# Altium project DRV8711EVM.PrjPCB
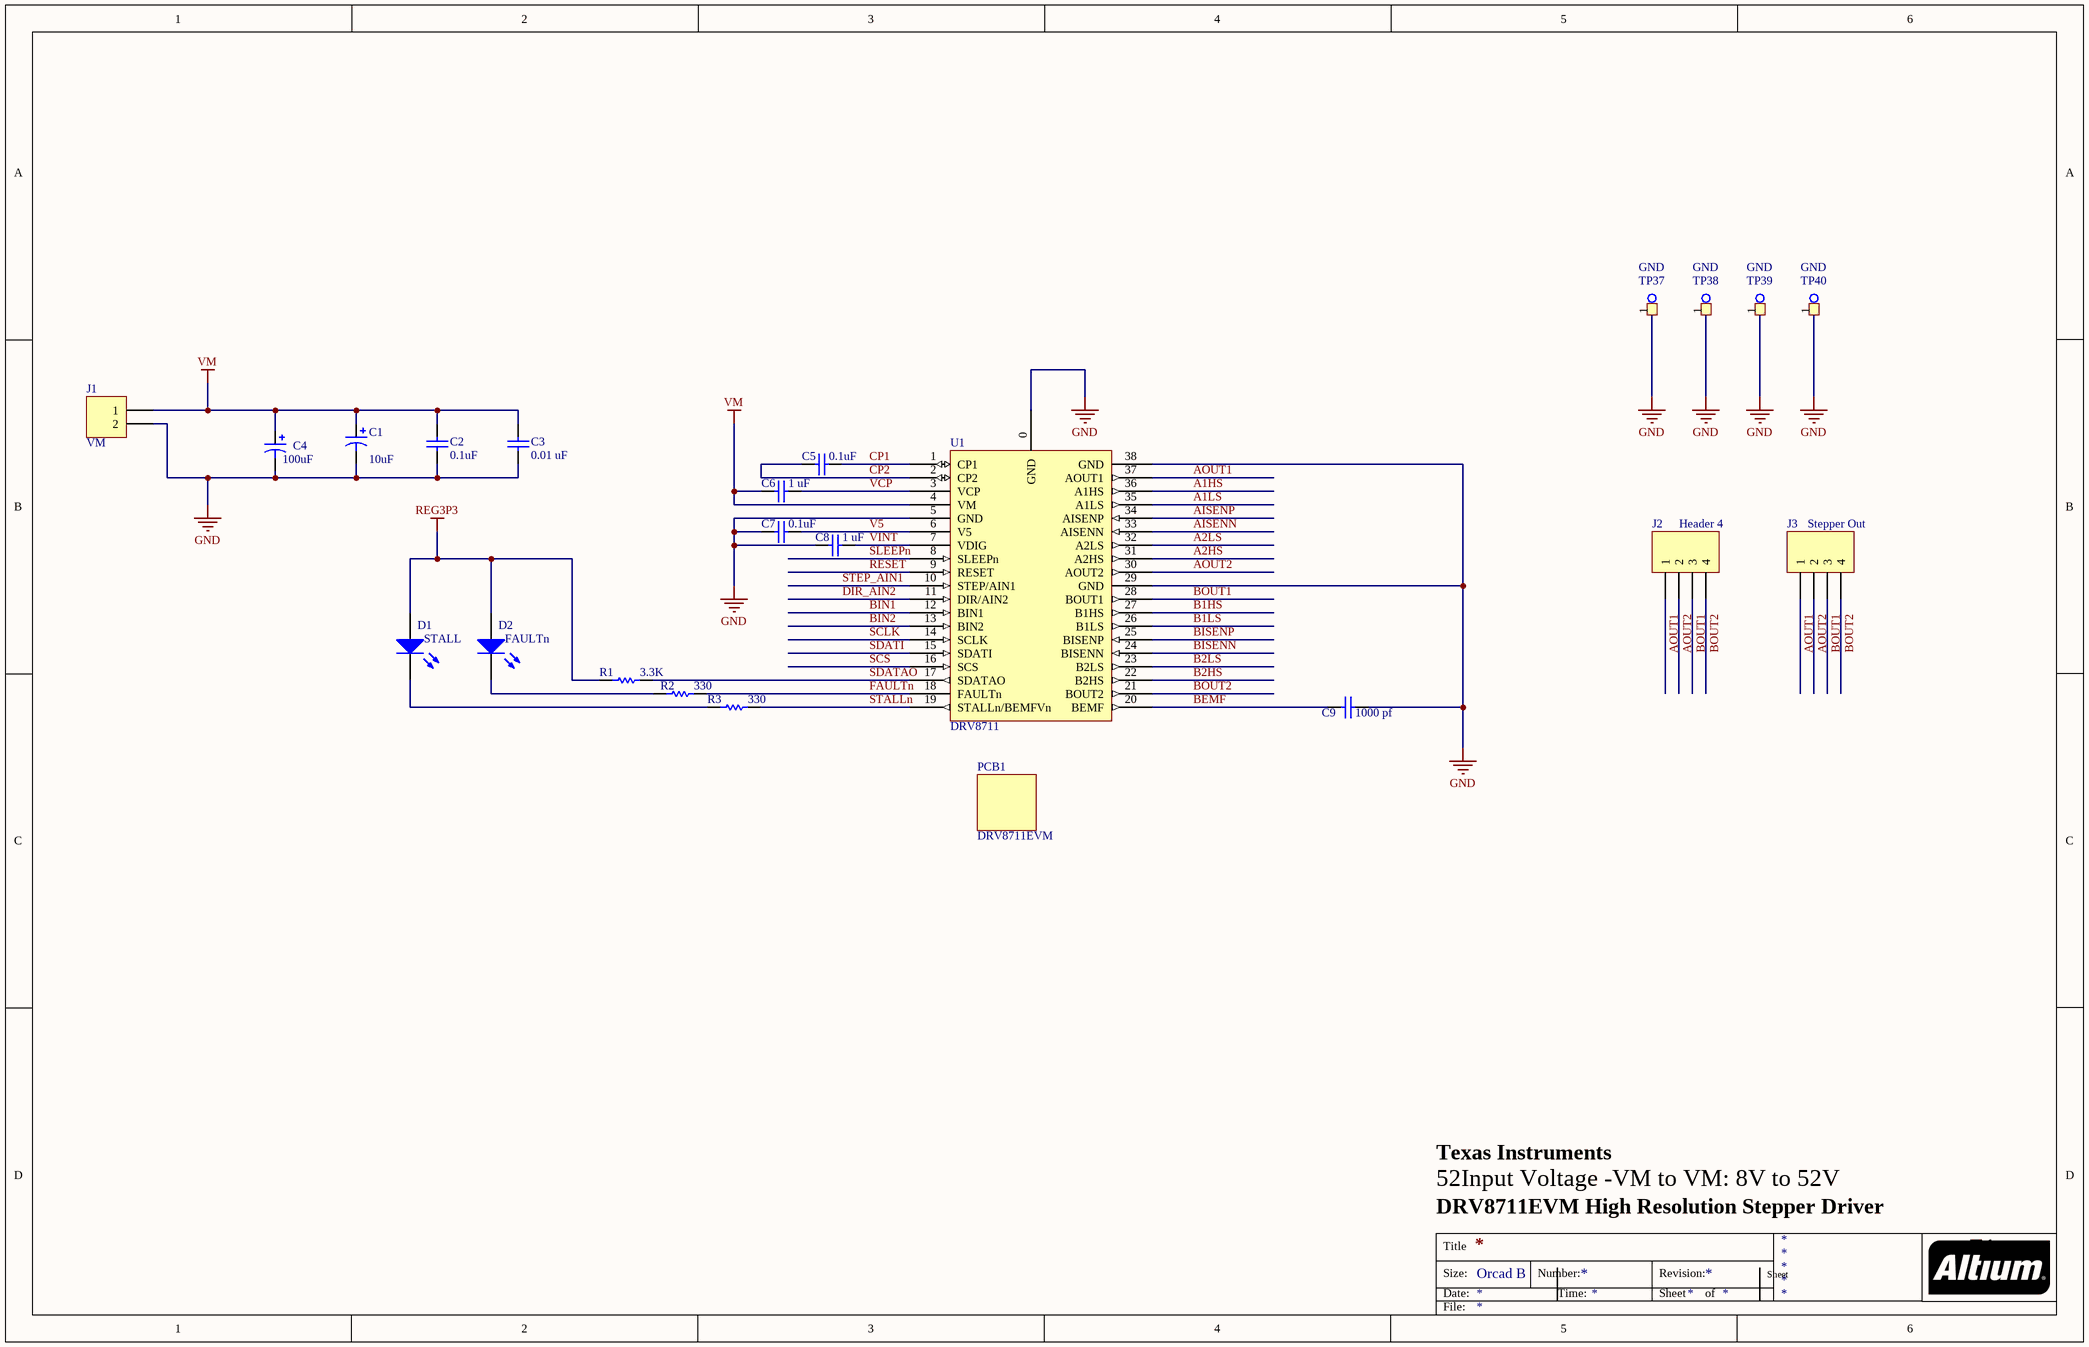
[diagram p0: DRV8711EVM.SchDoc]
3 sheets, 44 parts. Net scope: global (net labels, ports and power ports of the same name join across sheets).
Board file: DRV8711EVM.PcbDoc
Sheets:
  DRV8711EVM.SchDoc
  DRV8711_MSP430.SchDoc
  DRV8711EVM_FET.SchDoc

## Sheet DRV8711EVM.SchDoc
size OrCAD B; PageSetup: Record=PageOptions|CenterHorizontal=True|CenterVertical=True|PrintScale=0.54|XCorrection=1.00|YCorrection=1.00|PrintKind=0|BorderSize=5000000|LeftOffset=0|BottomOffset=0|Orientation=2|PaperLength=1000|PaperWidth=1000|Scale=100|PaperSource=15|PrintQuality=600|MediaType=1|DitherType=10|PaperKind=Letter|PrintScaleMode=1

### Parts
C1  value 10uF  [RB .1/.250 - SML]
C2  value 0.1uF  [0603-SMT]
C3  value 0.01 uF  [0603-SMT]
C4  value 100uF  [RB 5.0mm/12.5mm_NoPost]
C5  value 0.1uF  [0603-SMT]
C6  value 1 uF  [1206]
C7  value 0.1uF  [0603-SMT]
C8  value 1 uF  [0603-SMT]
C9  value 1000 pf  [0603-SMT]
D1  STALL  [1206_LED]
D2  FAULTn  [1206_LED]
J1  VM  [PWR_CONN2]
J2  Header 4  [PWR_CONN4]
J3  Stepper Out  [HDR1X4]
PCB1  DRV8711EVM  [TI_LOGO]
R1  value 3.3K  [0603-SMT]
R2  330  [0603-SMT]
R3  330  [0603-SMT]
TP37  GND  [TEST POINT 0.052]
TP38  GND  [TEST POINT 0.052]
TP39  GND  [TEST POINT 0.052]
TP40  GND  [TEST POINT 0.052]
U1  DRV8711  [DCP38 SMT]

### Nets
GND: C1.2 C2.2 C3.2 C4.2 C7.2 C8.2 C9.2 J1.2 TP37.1 TP38.1 TP39.1 TP40.1 U1.0(GND) U1.5(GND) U1.29(GND) U1.38(GND)
REG3P3: D1.1(A) D2.1(A) R1.2
VM: C1.1 C2.1 C3.1 C4.1 C6.2 J1.1 U1.4(VM)
A1HS: U1.36(A1HS)
A1LS: U1.35(A1LS)
A2HS: U1.31(A2HS)
A2LS: U1.32(A2LS)
AISENN: U1.33(AISENN)
AISENP: U1.34(AISENP)
AOUT1: J2.1 J3.1 U1.37(AOUT1)
AOUT2: J2.2 J3.2 U1.30(AOUT2)
B1HS: U1.27(B1HS)
B1LS: U1.26(B1LS)
B2HS: U1.22(B2HS)
B2LS: U1.23(B2LS)
BEMF: C9.1 U1.20(BEMF)
BIN1: U1.12(BIN1)
BIN2: U1.13(BIN2)
BISENN: U1.24(BISENN)
BISENP: U1.25(BISENP)
BOUT1: J2.3 J3.3 U1.28(BOUT1)
BOUT2: J2.4 J3.4 U1.21(BOUT2)
CP1: C5.1 U1.1(CP1)
CP2: C5.2 U1.2(CP2)
DIR_AIN2: U1.11(DIR/AIN2)
FAULTn: R2.1 U1.18(FAULTn)
RESET: U1.9(RESET)
SCLK: U1.14(SCLK)
SCS: U1.16(SCS)
SDATAO: R1.1 U1.17(SDATAO)
SDATI: U1.15(SDATI)
SLEEPn: U1.8(SLEEPn)
STALLn: R3.1 U1.19(STALLn/BEMFVn)
STEP_AIN1: U1.10(STEP/AIN1)
V5: C7.1 U1.6(V5)
VCP: C6.1 U1.3(VCP)
VINT: C8.1 U1.7(VDIG)
NetD1_2: D1.2(K) R3.2
NetD2_2: D2.2(K) R2.2

### Notes on the sheet
- Texas Instruments
- DRV8711EVM High Resolution Stepper Driver
- 52Input Voltage -VM to VM: 8V to 52V
- Sheet
- E1
- Title
- Size:
- Date:
- Orcad B
- Number:
- Time:
- Revision:
- of
- File:

### Library data of the parts
C1 = Cap Pol1: CAP ALUM 10UF 25V 20% RADIAL; MFG Part Number: UVR1E100MDD; Manufacturer: Nichicon; DK Part Number: 493-1057-ND
C2 C5 = Cap: Capacitor; Manufacturer: TDK; MFG Part Number: C1608X7S2A104M; DK Part Number: 445-5202-1-ND
  C5: Revision: July-2002: Re-released for DXP Platform.
C3 = Cap: Capacitor; Manufacturer: TDK; MFG Part Number: C1608X7R2A103K; DK Part Number: 445-1304-1-ND
C4 = Cap Pol1: CAP ALUM 100UF 100V 20% RADIAL; MFG Part Number: ECA-2AM101; Manufacturer: Panasonic; DK Part Number: P5313-ND
C6 = Cap: Capacitor; Manufacturer: TDK; MFG Part Number: C3216X7R1H105K; DK Part Number: 445-1423-1-ND
C7 = Cap: Capacitor; Manufacturer: Yageo; MFG Part Number: CC0603ZRY5V9BB104; DK Part Number: 311-1343-1-ND; Revision: July-2002: Re-released for DXP Platform.
C8 = Cap: Capacitor; Manufacturer: TDK; MFG Part Number: C1608Y5V1A105Z; DK Part Number: 445-1328-1-ND
C9 = Cap: Capacitor; Manufacturer: Yageo; MFG Part Number: CC0603JRNPO8BN102; DK Part Number: 311-1342-1-ND
D1 D2 = LED2: LED RED FACE UP 1206; DK Part Number: P11532CT-ND; Manufacturer: Panasonic; MFG Part Number: LNJ211R82RA; Value: Red LED
J1 = Header 2: TERM BLOCK 5.08MM VERT 2POS PCB; Manufacturer: On Shore Technologies; MFG Part Number: OSTTA024163; DK Part Number: ED2580-ND; Value: Connector
J2 = Header 4: TERM BLOCK 5.08MM VERT 4POS PCB; Manufacturer: On Shore Technologies; MFG Part Number: OSTTA044163; DK Part Number: ED2582-ND; Value: Terminal Block
J3 = Header 4: CONN HEADER .100 SNGL STR 4POS; DK Part Number: 929647-09-04-ND; Manufacturer: 3M; MFG Part Number: 929647-09-04-I; Value: 4 Pos Header
PCB1 = TI_LOGO: Bare Board; DK Part Number: Board; Manufacturer: Board; MFG Part Number: Board; Value: Board
R1 = Res1: RES 3.3K OHM 1/10W 5% 0603 SMD; Manufacturer: Panasonic; MFG Part Number: ERJ-3GEYJ332V; DK Part Number: P3.3KGCT-ND; Revision: July-2002: Re-released for DXP Platform.
R2 R3 = Res1: Resistor; MFG Part Number: RC0603JR-07330RL; Manufacturer: Yageo; DK Part Number: 311-330GRCT-ND; Value: 330
TP37-TP40 = TEST POINT: TEST POINT PC COMPACT .063"D BLK; Manufacturer: Keystone; MFG Part Number: 5006; DK Part Number: 5006K-ND; Value: BLACK
U1 = DRV8711: Pre Driver Stepper Motor Controller; Manufacturer: Texas Instruments; MFG Part Number: DRV8711DCP; DK Part Number: N/A; Value: Driver

## Sheet DRV8711_MSP430.SchDoc
size B
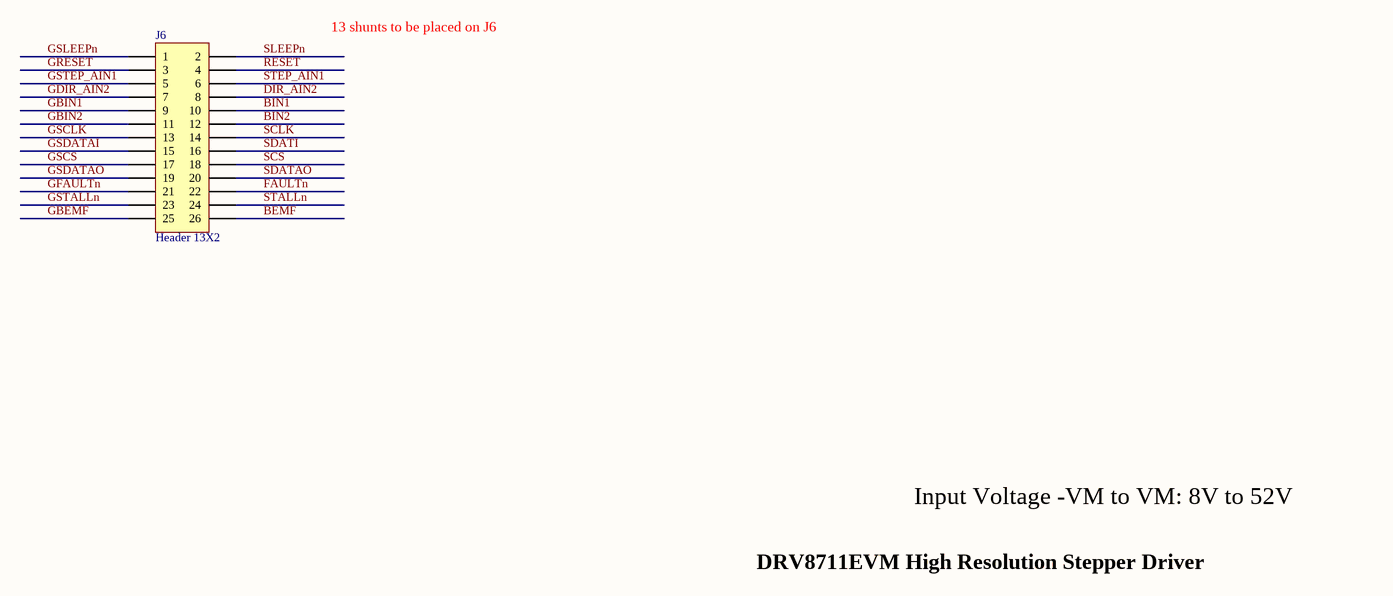
[diagram p1: DRV8711_MSP430.SchDoc]

### Parts
J6  Header 13X2  [HDR2X13]

### Nets
BEMF: J6.26
BIN1: J6.10
BIN2: J6.12
DIR_AIN2: J6.8
FAULTn: J6.22
GBEMF: J6.25
GBIN1: J6.9
GBIN2: J6.11
GDIR_AIN2: J6.7
GFAULTn: J6.21
GRESET: J6.3
GSCLK: J6.13
GSCS: J6.17
GSDATAI: J6.15
GSDATAO: J6.19
GSLEEPn: J6.1
GSTALLn: J6.23
GSTEP_AIN1: J6.5
RESET: J6.4
SCLK: J6.14
SCS: J6.18
SDATAO: J6.20
SDATI: J6.16
SLEEPn: J6.2
STALLn: J6.24
STEP_AIN1: J6.6

### Notes on the sheet
- 13 shunts to be placed on J6
- Input Voltage -VM to VM: 8V to 52V
- DRV8711EVM High Resolution Stepper Driver

### Library data of the parts
J6 = Header 13X2: CONN HEADER .100 DUAL STR 26POS; DK Part Number: 929665-09-13-ND; Manufacturer: 3M; MFG Part Number: 929665-09-13-I; Value: 26 Pos Header

## Sheet DRV8711EVM_FET.SchDoc
size B
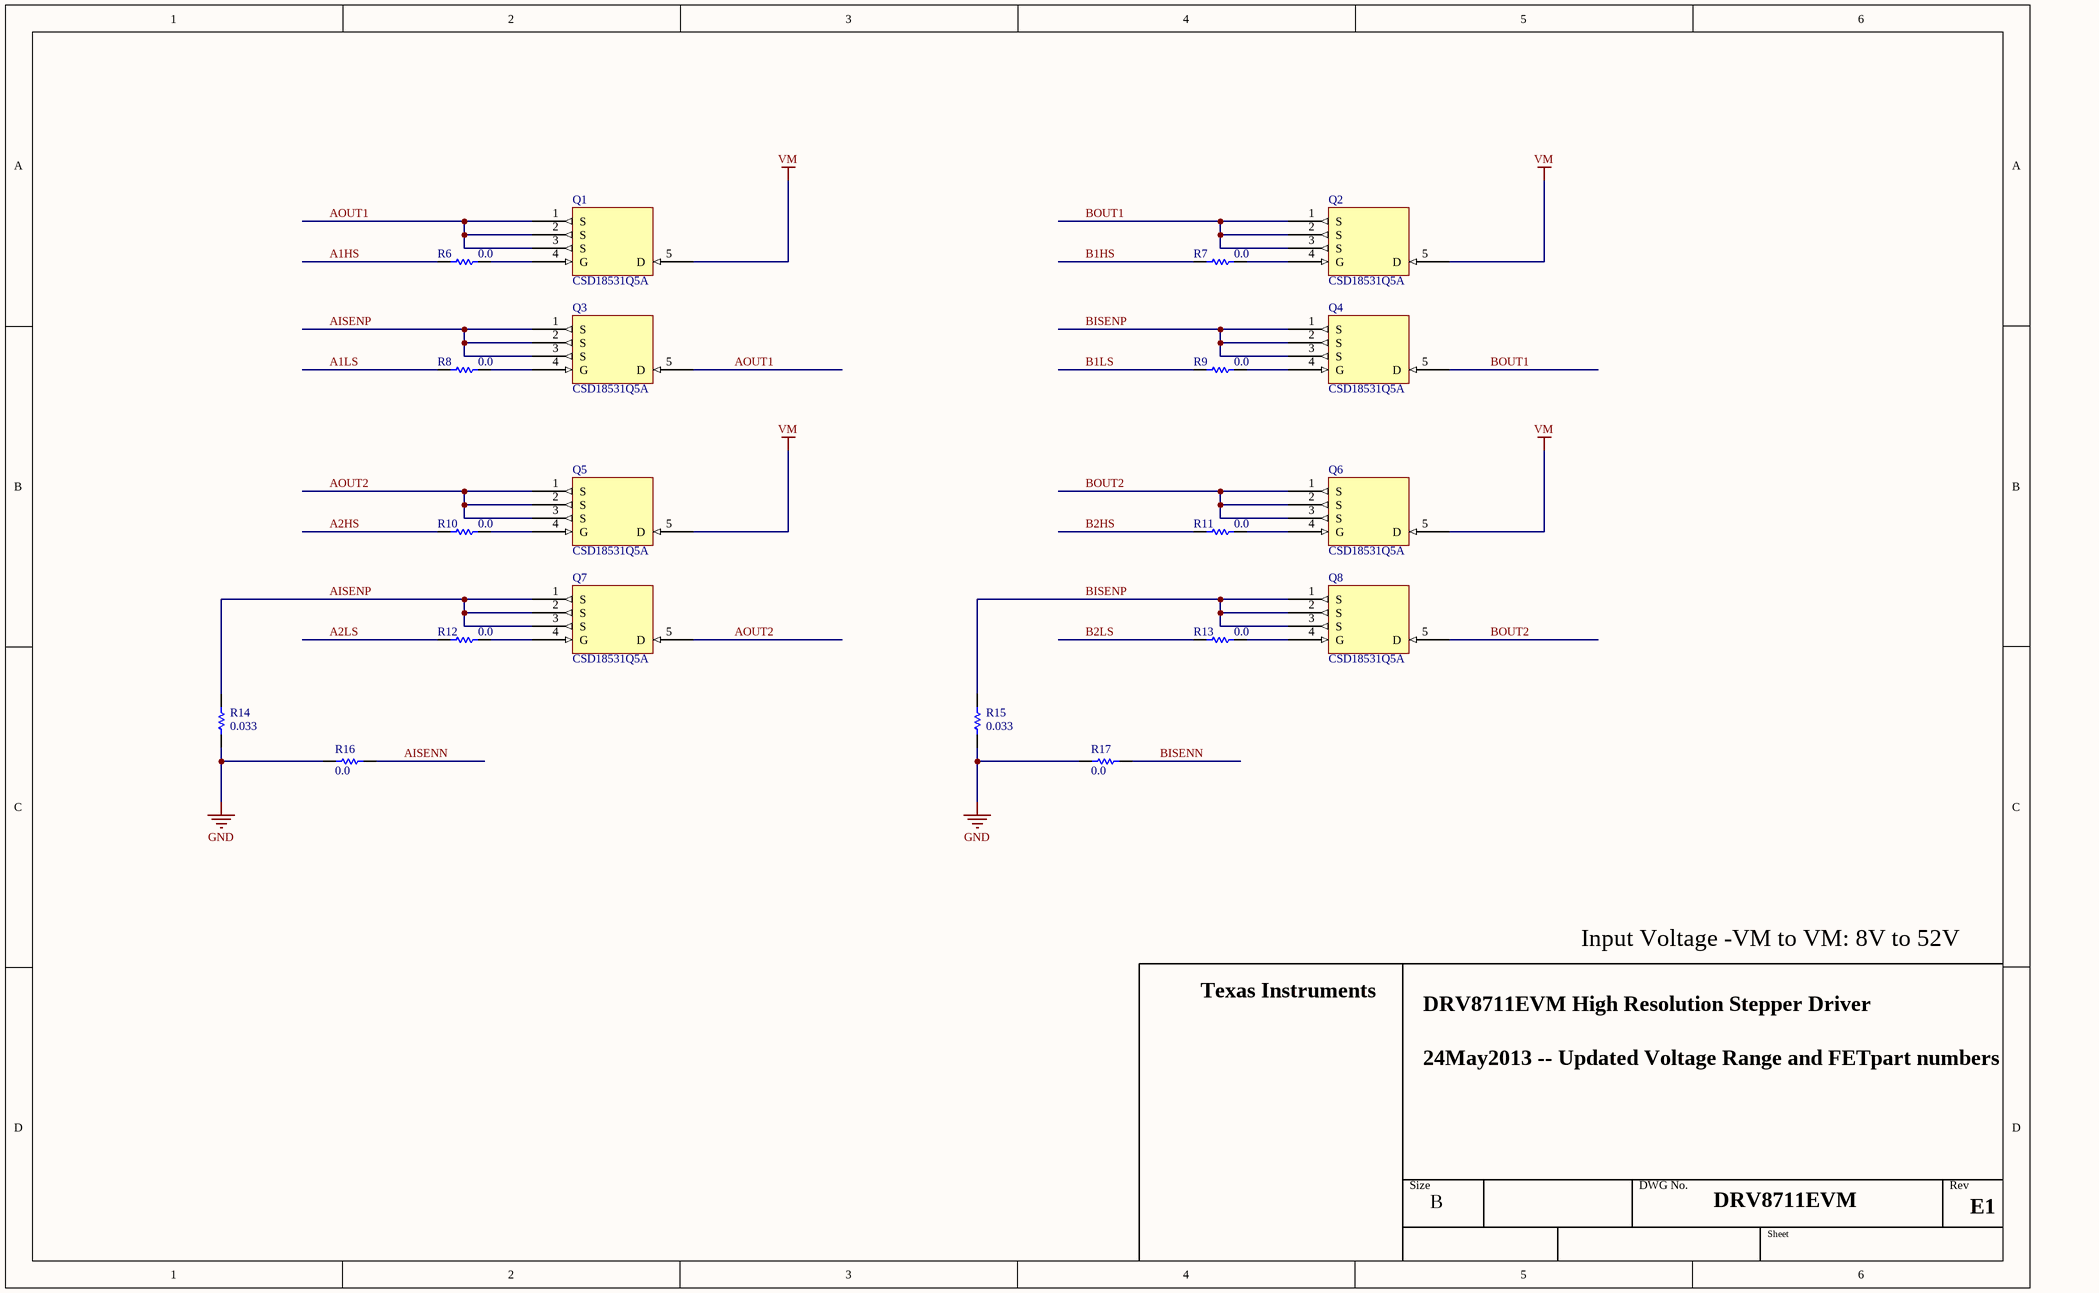
[diagram p2: DRV8711EVM_FET.SchDoc]

### Parts
Q1  CSD18531Q5A
Q2  CSD18531Q5A
Q3  CSD18531Q5A
Q4  CSD18531Q5A
Q5  CSD18531Q5A
Q6  CSD18531Q5A
Q7  CSD18531Q5A
Q8  CSD18531Q5A
R6  value 0.0  [0603-SMT]
R7  value 0.0  [0603-SMT]
R8  value 0.0  [0603-SMT]
R9  value 0.0  [0603-SMT]
R10  value 0.0  [0603-SMT]
R11  value 0.0  [0603-SMT]
R12  value 0.0  [0603-SMT]
R13  value 0.0  [0603-SMT]
R14  0.033  [2818]
R15  0.033  [2818]
R16  value 0.0  [0603-SMT]
R17  value 0.0  [0603-SMT]

### Nets
GND: R14.1 R15.1 R16.2 R17.2
VM: Q1.5(D) Q2.5(D) Q5.5(D) Q6.5(D)
A1HS: R6.1
A1LS: R8.1
A2HS: R10.1
A2LS: R12.1
AISENN: R16.1
AISENP: Q3.1(S) Q3.2(S) Q3.3(S) Q7.1(S) Q7.2(S) Q7.3(S) R14.2
AOUT1: Q1.1(S) Q1.2(S) Q1.3(S) Q3.5(D)
AOUT2: Q5.1(S) Q5.2(S) Q5.3(S) Q7.5(D)
B1HS: R7.1
B1LS: R9.1
B2HS: R11.1
B2LS: R13.1
BISENN: R17.1
BISENP: Q4.1(S) Q4.2(S) Q4.3(S) Q8.1(S) Q8.2(S) Q8.3(S) R15.2
BOUT1: Q2.1(S) Q2.2(S) Q2.3(S) Q4.5(D)
BOUT2: Q6.1(S) Q6.2(S) Q6.3(S) Q8.5(D)
NetQ1_4: Q1.4(G) R6.2
NetQ2_4: Q2.4(G) R7.2
NetQ3_4: Q3.4(G) R8.2
NetQ4_4: Q4.4(G) R9.2
NetQ5_4: Q5.4(G) R10.2
NetQ6_4: Q6.4(G) R11.2
NetQ7_4: Q7.4(G) R12.2
NetQ8_4: Q8.4(G) R13.2

### Notes on the sheet
- Input Voltage -VM to VM: 8V to 52V
- Texas Instruments
- DRV8711EVM High Resolution Stepper Driver
- 24May2013 -- Updated Voltage Range and FETpart numbers
- Size
- B
- DWG No.
- DRV8711EVM
- Sheet
- Rev
- E1

### Library data of the parts
Q1-Q8 = IRLH5034: MOSFET N-CH 60V 8SON; Manufacturer: Texas Instruments; DK Part Number: CSD18531Q5A; MFG Part Number: CSD18531Q5A; Value: MOSFET
R6-R13 R16 R17 = Res1: RES 0.0 OHM 1/10W 0603 SMD; Manufacturer: Panasonic; MFG Part Number: ERJ-3GEY0R00V; DK Part Number: P0.0GCT-ND
R14 R15 = Res1: Resistor; MFG Part Number: WSH2818R0330FEA; Manufacturer: Vishay; DK Part Number: WSHA-.033CT-ND; Value: 0.033

## Nets that join several sheets
GND: DRV8711EVM (16 pins), DRV8711EVM_FET (R14.1 R15.1 R16.2 R17.2)
VM: DRV8711EVM (7 pins), DRV8711EVM_FET (Q1.5 Q2.5 Q5.5 Q6.5)
A1HS: DRV8711EVM (U1.36), DRV8711EVM_FET (R6.1)
A1LS: DRV8711EVM (U1.35), DRV8711EVM_FET (R8.1)
A2HS: DRV8711EVM (U1.31), DRV8711EVM_FET (R10.1)
A2LS: DRV8711EVM (U1.32), DRV8711EVM_FET (R12.1)
AISENN: DRV8711EVM (U1.33), DRV8711EVM_FET (R16.1)
AISENP: DRV8711EVM (U1.34), DRV8711EVM_FET (7 pins)
AOUT1: DRV8711EVM (J2.1 J3.1 U1.37), DRV8711EVM_FET (Q1.1 Q1.2 Q1.3 Q3.5)
AOUT2: DRV8711EVM (J2.2 J3.2 U1.30), DRV8711EVM_FET (Q5.1 Q5.2 Q5.3 Q7.5)
B1HS: DRV8711EVM (U1.27), DRV8711EVM_FET (R7.1)
B1LS: DRV8711EVM (U1.26), DRV8711EVM_FET (R9.1)
B2HS: DRV8711EVM (U1.22), DRV8711EVM_FET (R11.1)
B2LS: DRV8711EVM (U1.23), DRV8711EVM_FET (R13.1)
BEMF: DRV8711EVM (C9.1 U1.20), DRV8711_MSP430 (J6.26)
BIN1: DRV8711EVM (U1.12), DRV8711_MSP430 (J6.10)
BIN2: DRV8711EVM (U1.13), DRV8711_MSP430 (J6.12)
BISENN: DRV8711EVM (U1.24), DRV8711EVM_FET (R17.1)
BISENP: DRV8711EVM (U1.25), DRV8711EVM_FET (7 pins)
BOUT1: DRV8711EVM (J2.3 J3.3 U1.28), DRV8711EVM_FET (Q2.1 Q2.2 Q2.3 Q4.5)
BOUT2: DRV8711EVM (J2.4 J3.4 U1.21), DRV8711EVM_FET (Q6.1 Q6.2 Q6.3 Q8.5)
DIR_AIN2: DRV8711EVM (U1.11), DRV8711_MSP430 (J6.8)
FAULTn: DRV8711EVM (R2.1 U1.18), DRV8711_MSP430 (J6.22)
RESET: DRV8711EVM (U1.9), DRV8711_MSP430 (J6.4)
SCLK: DRV8711EVM (U1.14), DRV8711_MSP430 (J6.14)
SCS: DRV8711EVM (U1.16), DRV8711_MSP430 (J6.18)
SDATAO: DRV8711EVM (R1.1 U1.17), DRV8711_MSP430 (J6.20)
SDATI: DRV8711EVM (U1.15), DRV8711_MSP430 (J6.16)
SLEEPn: DRV8711EVM (U1.8), DRV8711_MSP430 (J6.2)
STALLn: DRV8711EVM (R3.1 U1.19), DRV8711_MSP430 (J6.24)
STEP_AIN1: DRV8711EVM (U1.10), DRV8711_MSP430 (J6.6)

## Assembly variants
DRV8711EVM: not fitted SHNT1